# Altium schematic sheet LPCB279 - AND GATES.SchDoc
size A3; Address1: Factory 10; Address2: 9-13 Dingley Avenue, Dandeong, VICTORIA 3175, AUSTRALIA; DocumentNumber: 3; Revision: 1; SheetNumber: 3; SheetTotal: 7; Lockie__PCB_SUB_ASSEMBLY: PCB Sub Component; Lockie__PCB_ASSEMBLY: PCB Assembly; Lockie__LDL: LPCB279; Lockie__PCB_DESCRIPTION: Landing Gear Unit
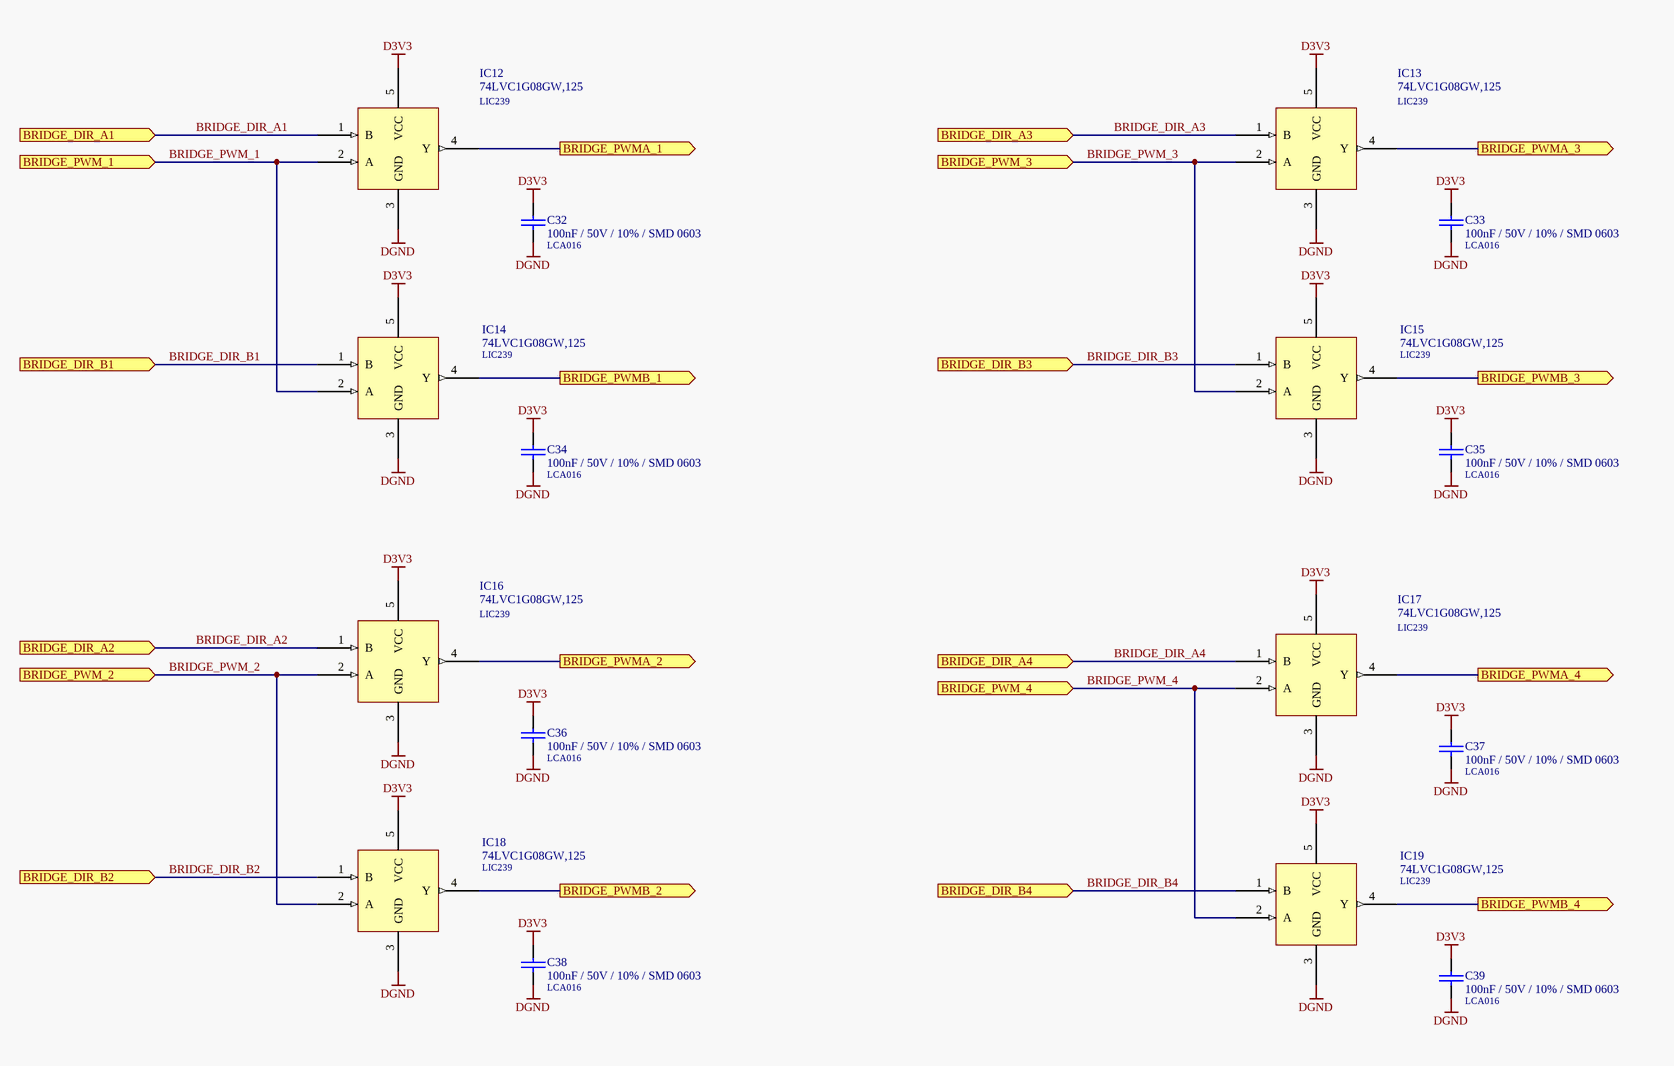
[diagram p0: LPCB279 - AND GATES.SchDoc]

## Parts
C32  100nF / 50V / 10% / SMD 0603  LDL_NUMBER: LCA016  [LFP011__CC1608-0603-IPC7351_B]
C33  100nF / 50V / 10% / SMD 0603  LDL_NUMBER: LCA016  [LFP011__CC1608-0603-IPC7351_B]
C34  100nF / 50V / 10% / SMD 0603  LDL_NUMBER: LCA016  [LFP011__CC1608-0603-IPC7351_B]
C35  100nF / 50V / 10% / SMD 0603  LDL_NUMBER: LCA016  [LFP011__CC1608-0603-IPC7351_B]
C36  100nF / 50V / 10% / SMD 0603  LDL_NUMBER: LCA016  [LFP011__CC1608-0603-IPC7351_B]
C37  100nF / 50V / 10% / SMD 0603  LDL_NUMBER: LCA016  [LFP011__CC1608-0603-IPC7351_B]
C38  100nF / 50V / 10% / SMD 0603  LDL_NUMBER: LCA016  [LFP011__CC1608-0603-IPC7351_B]
C39  100nF / 50V / 10% / SMD 0603  LDL_NUMBER: LCA016  [LFP011__CC1608-0603-IPC7351_B]
IC12  74LVC1G08GW,125  LDL_NUMBER: LIC239  [LFP047__SOT353]
IC13  74LVC1G08GW,125  LDL_NUMBER: LIC239  [LFP047__SOT353]
IC14  74LVC1G08GW,125  LDL_NUMBER: LIC239  [LFP047__SOT353]
IC15  74LVC1G08GW,125  LDL_NUMBER: LIC239  [LFP047__SOT353]
IC16  74LVC1G08GW,125  LDL_NUMBER: LIC239  [LFP047__SOT353]
IC17  74LVC1G08GW,125  LDL_NUMBER: LIC239  [LFP047__SOT353]
IC18  74LVC1G08GW,125  LDL_NUMBER: LIC239  [LFP047__SOT353]
IC19  74LVC1G08GW,125  LDL_NUMBER: LIC239  [LFP047__SOT353]

## Ports
BRIDGE_DIR_A1 (in), BRIDGE_DIR_A2 (in), BRIDGE_DIR_A3 (in), BRIDGE_DIR_A4 (in), BRIDGE_DIR_B1 (in), BRIDGE_DIR_B2 (in), BRIDGE_DIR_B3 (in), BRIDGE_DIR_B4 (in), BRIDGE_PWM_1 (in), BRIDGE_PWM_2 (in), BRIDGE_PWM_3 (in), BRIDGE_PWM_4 (in), BRIDGE_PWMA_1 (out), BRIDGE_PWMA_2 (out), BRIDGE_PWMA_3 (out), BRIDGE_PWMA_4 (out), BRIDGE_PWMB_1 (out), BRIDGE_PWMB_2 (out), BRIDGE_PWMB_3 (out), BRIDGE_PWMB_4 (out)

## Nets
D3V3: C32.1 C33.1 C34.1 C35.1 C36.1 C37.1 C38.1 C39.1 IC12.5(VCC) IC13.5(VCC) IC14.5(VCC) IC15.5(VCC) IC16.5(VCC) IC17.5(VCC) IC18.5(VCC) IC19.5(VCC)
DGND: C32.2 C33.2 C34.2 C35.2 C36.2 C37.2 C38.2 C39.2 IC12.3(GND) IC13.3(GND) IC14.3(GND) IC15.3(GND) IC16.3(GND) IC17.3(GND) IC18.3(GND) IC19.3(GND)
BRIDGE_DIR_A1: IC12.1(B) ; port BRIDGE_DIR_A1
BRIDGE_DIR_A2: IC16.1(B) ; port BRIDGE_DIR_A2
BRIDGE_DIR_A3: IC13.1(B) ; port BRIDGE_DIR_A3
BRIDGE_DIR_A4: IC17.1(B) ; port BRIDGE_DIR_A4
BRIDGE_DIR_B1: IC14.1(B) ; port BRIDGE_DIR_B1
BRIDGE_DIR_B2: IC18.1(B) ; port BRIDGE_DIR_B2
BRIDGE_DIR_B3: IC15.1(B) ; port BRIDGE_DIR_B3
BRIDGE_DIR_B4: IC19.1(B) ; port BRIDGE_DIR_B4
BRIDGE_PWM_1: IC12.2(A) IC14.2(A) ; port BRIDGE_PWM_1
BRIDGE_PWM_2: IC16.2(A) IC18.2(A) ; port BRIDGE_PWM_2
BRIDGE_PWM_3: IC13.2(A) IC15.2(A) ; port BRIDGE_PWM_3
BRIDGE_PWM_4: IC17.2(A) IC19.2(A) ; port BRIDGE_PWM_4
BRIDGE_PWMA_1: IC12.4(Y) ; port BRIDGE_PWMA_1
BRIDGE_PWMA_2: IC16.4(Y) ; port BRIDGE_PWMA_2
BRIDGE_PWMA_3: IC13.4(Y) ; port BRIDGE_PWMA_3
BRIDGE_PWMA_4: IC17.4(Y) ; port BRIDGE_PWMA_4
BRIDGE_PWMB_1: IC14.4(Y) ; port BRIDGE_PWMB_1
BRIDGE_PWMB_2: IC18.4(Y) ; port BRIDGE_PWMB_2
BRIDGE_PWMB_3: IC15.4(Y) ; port BRIDGE_PWMB_3
BRIDGE_PWMB_4: IC19.4(Y) ; port BRIDGE_PWMB_4

## Notes on the sheet
- PCB COMPONENT DESCRIPTION
- LDL NUMBER
- Assembly Details
- Size
- Drawing File Name
- Revision
- http://sil3.com.au
  ACN: 123 529 064
  Factory 10
  9-13 Dingley Avenue
  Dandenong, VICTORIA
  Australia
- Scale
- A3
- Sheet Details
- N.T.S
- Sheet:
- Of:

## Library data of the parts
C32-C39 = 100nF / 50V / 10% / SMD 0603: Capacitor, Ceramic Chip, 100nF (0.1uF), 50V, 5%, SMD 0603 [LCA016]; Value: 100n; FMEDA__OPERATING__VOLTAGE_MIN: 0; FMEDA__OPERATING__VOLTAGE_MAX: 3.3; FMEDA__OPERATING__TEMP_MIN: -20; FMEDA__OPERATING__TEMP_TYP: 27; FMEDA__OPERATING__TEMP_MAX: 50; FMEDA__CHANNEL: COM; FMEDA__FUNCTION_IN_SYSTEM: *; FMEDA__OPERATING__VOLTAGE_TYP: 3.3
IC12-IC19 = 74LVC1G08GW,125: IC, Logic AND Gate, Single 2 Input, SMD SOT353 [LIC239]; FMEDA__OPERATING__TEMP_MAX: 50; FMEDA__OPERATING__TEMP_MIN: -20; FMEDA__OPERATING__TEMP_TYP: 27; FMEDA__OPERATING__VOLTAGE_MAX: 0; FMEDA__CHANNEL: COM; FMEDA__FUNCTION_IN_SYSTEM: *; FMEDA__OPERATING__VOLTAGE_MIN: 0; FMEDA__OPERATING__VOLTAGE_TYP: 0